# Altium project ECGSingleLead.PrjPcb
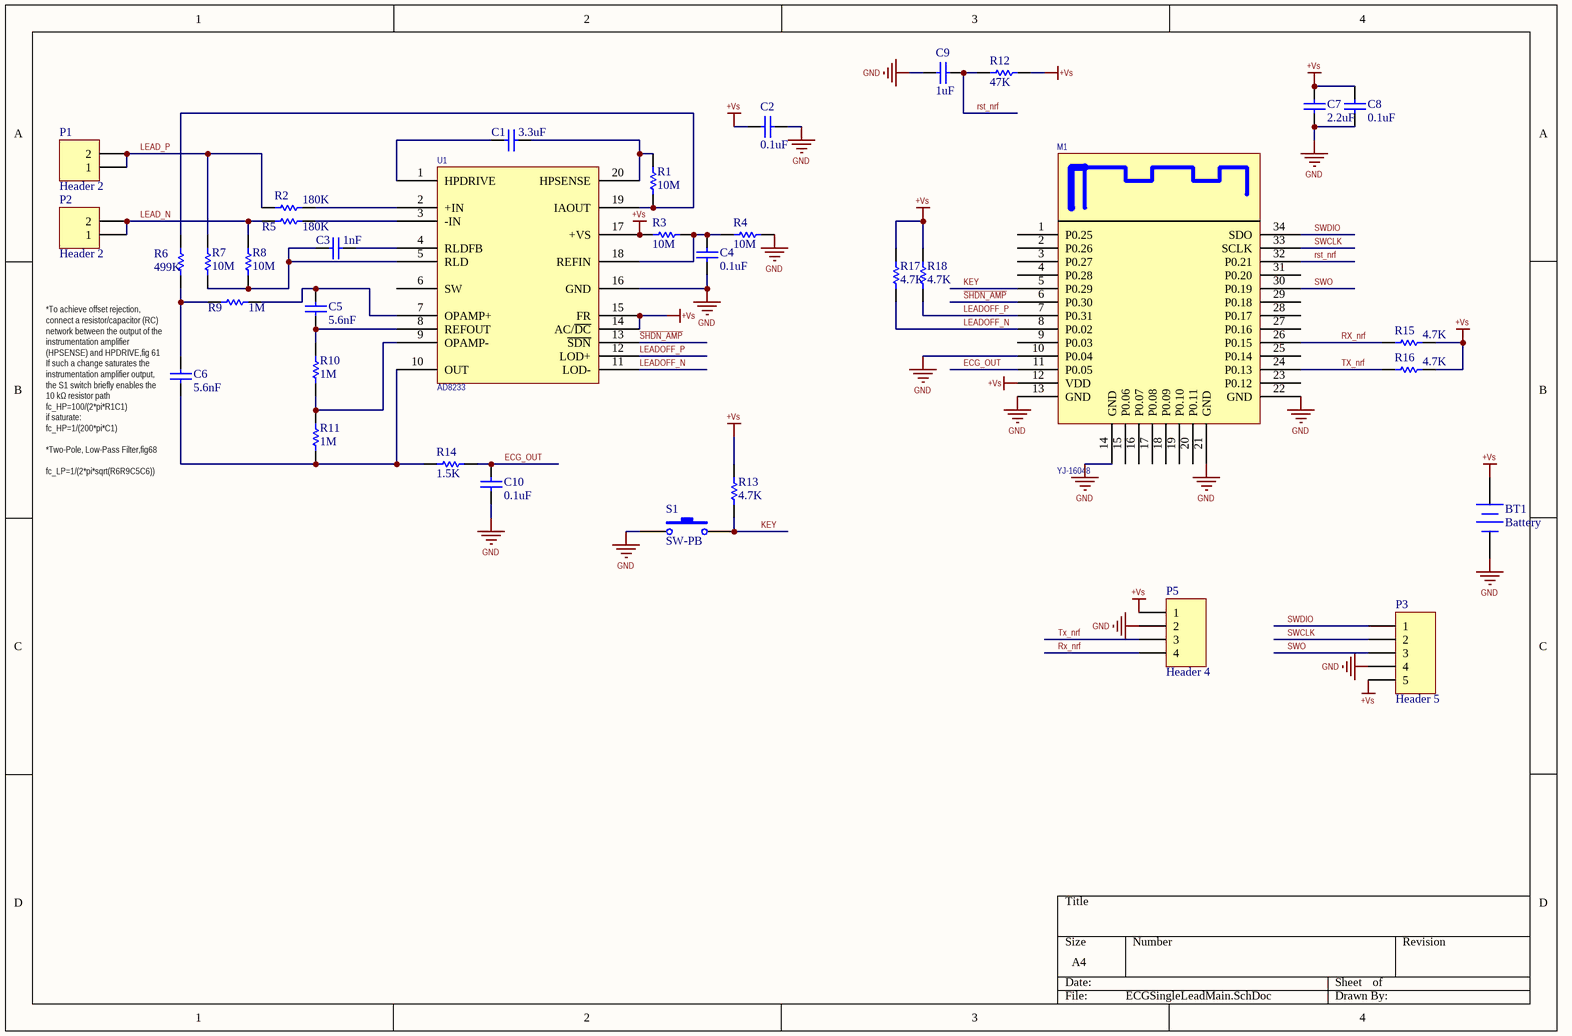
[diagram p0: ECGSingleLeadMain.SchDoc]
1 sheet, 36 parts. Net scope: global (net labels, ports and power ports of the same name join across sheets).
Board file: ECGSingleLead.PcbDoc

## Sheet ECGSingleLeadMain.SchDoc
size A4

### Parts
BT1  Battery  [BTH2032_DIP]
C1  value 3.3uF  [CAP0603]  (hidden comment: Cap)
C2  value 0.1uF  [CAP0603]  (hidden comment: Cap)
C3  value 1nF  [CAP0603]  (hidden comment: Cap)
C4  value 0.1uF  [CAP0603]  (hidden comment: Cap)
C5  value 5.6nF  [CAP0603]  (hidden comment: Cap)
C6  value 5.6nF  [CAP0603]  (hidden comment: Cap)
C7  value 2.2uF  [CAP0603]  (hidden comment: Cap)
C8  value 0.1uF  [CAP0603]  (hidden comment: Cap)
C9  value 1uF  [CAP0603]  (hidden comment: Cap)
C10  value 0.1uF  [CAP0603]  (hidden comment: Cap)
M1  YJ-16048  [YJ-16048]
P1  Header 2  [HDR1X2]
P2  Header 2  [HDR1X2]
P3  Header 5  [HDR1X5]
P5  Header 4  [HDR1X4]
R1  value 10M  [RES0603]  (hidden comment: Res1)
R2  value 180K  [RES0603]  (hidden comment: Res1)
R3  value 10M  [RES0603]  (hidden comment: Res1)
R4  value 10M  [RES0603]  (hidden comment: Res1)
R5  value 180K  [RES0603]  (hidden comment: Res1)
R6  value 499K  [RES0603]  (hidden comment: Res1)
R7  value 10M  [RES0603]  (hidden comment: Res1)
R8  value 10M  [RES0603]  (hidden comment: Res1)
R9  value 1M  [RES0603]  (hidden comment: Res1)
R10  value 1M  [RES0603]  (hidden comment: Res1)
R11  value 1M  [RES0603]  (hidden comment: Res1)
R12  value 47K  [RES0603]  (hidden comment: Res1)
R13  value 4.7K  [RES0603]  (hidden comment: Res1)
R14  value 1.5K  [RES0603]  (hidden comment: Res1)
R15  value 4.7K  [RES0603]  (hidden comment: Res1)
R16  value 4.7K  [RES0603]  (hidden comment: Res1)
R17  value 4.7K  [RES0603]  (hidden comment: Res1)
R18  value 4.7K  [RES0603]  (hidden comment: Res1)
S1  SW-PB  [SW-4PIN-SMD]
U1  AD8233  [CP-20-8]

### Nets
+Vs: BT1.1(+) C2.2 C7.1 C8.1 M1.12(VDD) P3.5 P5.1 R3.1 R12.1 R13.2 R15.1 R16.2 R17.1 R18.2 U1.14(AC/~{DC}) U1.15(FR) U1.17(+VS)
GND: BT1.2(-) C2.1 C4.1 C7.2 C8.2 C9.2 C10.2 M1.10(P0.04) M1.13(GND) M1.14(GND) M1.21(GND) M1.22(GND) P3.4 P5.2 R4.1 S1.2 U1.16(GND)
ECG_OUT: C10.1 M1.11(P0.05) R14.2
KEY: M1.5(P0.29) R13.1 S1.1
LEAD_N: P2.1 P2.2 R5.1 R8.1
LEAD_P: P1.1 P1.2 R2.1 R7.1
LEADOFF_N: M1.8(P0.02) R17.2 U1.11(LOD-)
LEADOFF_P: M1.7(P0.31) R18.1 U1.12(LOD+)
rst_nrf: C9.1 M1.32(P0.21) R12.2
Rx_nrf: M1.26(P0.15) P5.4 R15.2
~{SHDN_AMP}: M1.6(P0.30) U1.13(~{SDN})
SWCLK: M1.33(SCLK) P3.2
SWDIO: M1.34(SDO) P3.1
SWO: M1.30(P0.19) P3.3
Tx_nrf: M1.24(P0.13) P5.3 R16.1
NetC1_1: C1.1 R1.1 U1.20(HPSENSE)
NetC1_2: C1.2 U1.1(HPDRIVE)
NetC3_1: C3.1 U1.4(RLDFB)
NetC3_2: C3.2 R7.2 R8.2 U1.5(RLD)
NetC4_2: C4.2 R3.2 R4.2 U1.18(REFIN)
NetC5_1: C5.1 R9.1 U1.7(OPAMP+)
NetC5_2: C5.2 R10.2 U1.8(REFOUT)
NetC6_1: C6.1 R6.2 R9.2
NetC6_2: C6.2 R11.1 R14.1 U1.10(OUT)
NetR1_2: R1.2 R6.1 U1.19(IAOUT)
NetR2_2: R2.2 U1.2(+IN)
NetR5_2: R5.2 U1.3(-IN)
NetR10_1: R10.1 R11.2 U1.9(OPAMP-)

Not connected (* = marked no-connect by the designer): M1 1(P0.25) 2(P0.26) 3(P0.27) 4(P0.28) 9(P0.03) 15(P0.06) 16(P0.07) 17(P0.08) 18(P0.09) 19(P0.10) 20(P0.11) 23(P0.12) 25(P0.14) 27(P0.16) 28(P0.17) 29(P0.18) 31(P0.20); U1 6(SW)

### Notes on the sheet
- (near C6) *To achieve offset rejection, connect a resistor/capacitor (RC) network between the output of the instrumentation amplifier (HPSENSE) and HPDRIVE,fig 61
  If such a change saturates the instrumentation amplifier output, the S1 switch briefly enables the 10 kΩ resistor path
  fc_HP=100/(2*pi*R1C1)
  if saturate:
  fc_HP=1/(200*pi*C1)
  *Two-Pole, Low-Pass Filter,fig68
  fc_LP=1/(2*pi*sqrt(R6R9C5C6))

### Library data of the parts
BT1 = Battery: Multicell Battery; Published: 24-Mar-1999; LatestRevisionDate: 17-Jul-2002; LatestRevisionNote: Re-released for DXP Platform.; PackageReference: BAT-2; Publisher: Altium Limited; PackageDescription: Battery; 2 Leads
C1-C10 = Cap: Capacitor; Published: 8-Jun-2000; LatestRevisionDate: 17-Jul-2002; LatestRevisionNote: Re-released for DXP Platform.; PackageReference: RAD-0.3; Publisher: Altium Limited; PackageDescription: Radial Cap, Thru-Hole; 2 Leads; 0.3 in Pin Spacing
M1 = nrf52832-M: nrf52832 Module-Bluetooth 5.0 Low Energy Module; LatestRevisionDate: 17-Jul-2002; LatestRevisionNote: Re-released for DXP Platform.; Publisher: Altium Limited
P1 P2 = Header 2: Header, 2-Pin; LatestRevisionDate: 17-Jul-2002; LatestRevisionNote: Re-released for DXP Platform.; Publisher: Altium Limited
P3 = Header 5: Header, 5-Pin; LatestRevisionDate: 17-Jul-2002; LatestRevisionNote: Re-released for DXP Platform.; Publisher: Altium Limited
P5 = Header 4: Header, 4-Pin; LatestRevisionDate: 17-Jul-2002; LatestRevisionNote: Re-released for DXP Platform.; Publisher: Altium Limited
R1-R18 = Res1: Resistor; Published: 8-Jun-2000; LatestRevisionDate: 17-Jul-2002; LatestRevisionNote: Re-released for DXP Platform.; PackageReference: AXIAL-0.3; Publisher: Altium Limited; PackageDescription: Axial Device, Thru-Hole; 2 Leads; 0.3 in Pin Spacing
S1 = SW-PB: Switch; Published: 24-Mar-1999; LatestRevisionDate: 17-Jul-2002; LatestRevisionNote: Re-released for DXP Platform.; PackageReference: SPST-2; Publisher: Altium Limited; PackageDescription: Switch; 2 Leads
U1 = AD8232: Single-Lead, Heart Rate Monitor Front End; LatestRevisionDate: 17-Jul-2002; LatestRevisionNote: Re-released for DXP Platform.; Publisher: Altium Limited